# EAGLE design wheelSense_revA (EAGLE 8.0.0)
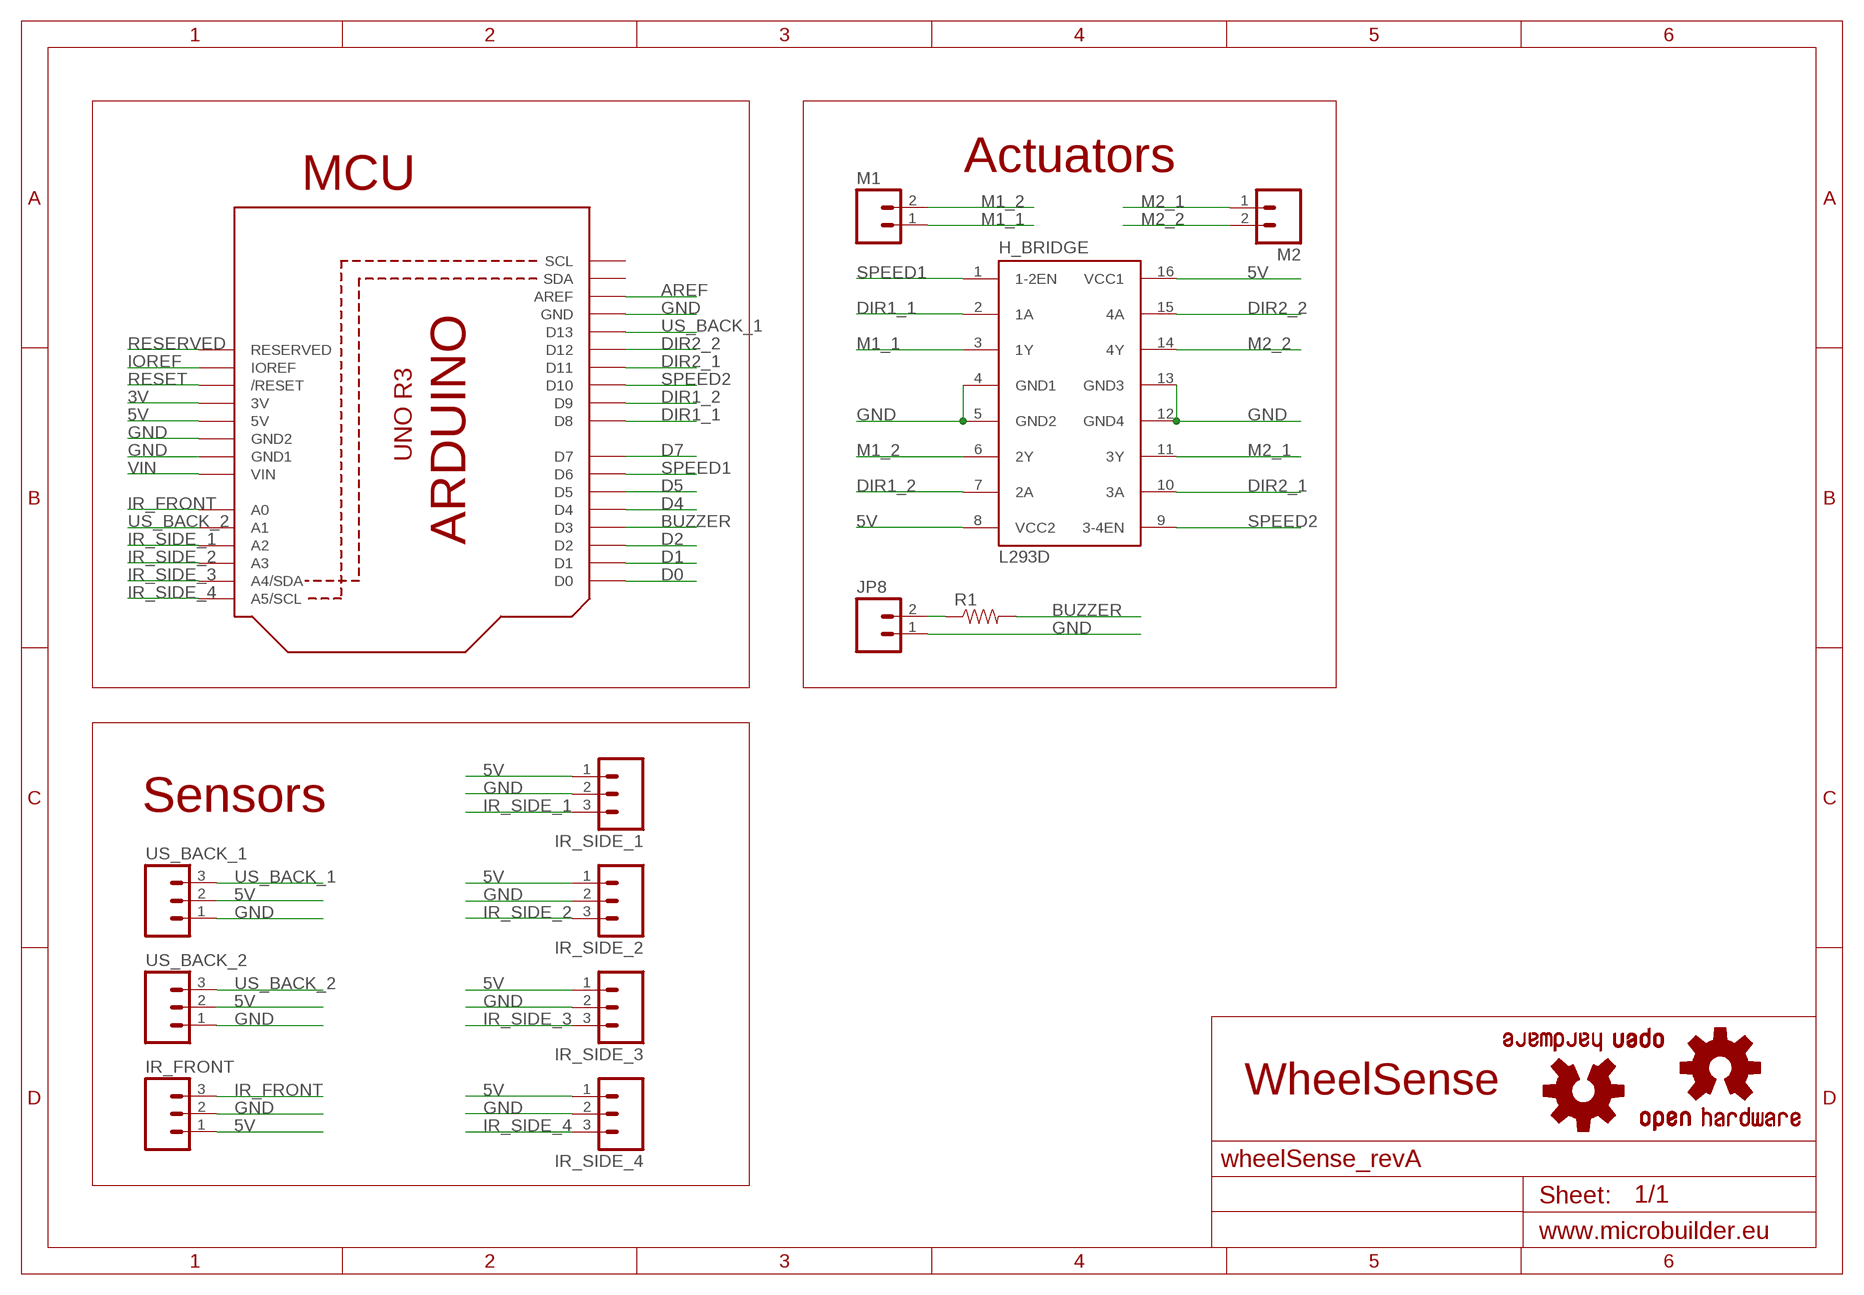
[diagram p0: schematic, sheet 1]

## Parts
H_BRIDGE  L293D  [DIL16]
IR_FRONT  M03POLAR  [MOLEX-1X3]
IR_SIDE_1  M03POLAR  [MOLEX-1X3]
IR_SIDE_2  M03POLAR  [MOLEX-1X3]
IR_SIDE_3  M03POLAR  [MOLEX-1X3]
IR_SIDE_4  M03POLAR  [MOLEX-1X3]
JP8  M02POLAR  [MOLEX-1X2]
LOGO1  OSHW-LOGOL-TOP  [OSHW_LOGO_L_TOP]
LOGO2  OSHW-LOGOL-TOP  [OSHW_LOGO_L_TOP]
M1  M02POLAR  [MOLEX-1X2]
M2  M02POLAR  [MOLEX-1X2]
R1  RESISTORPTH-1/4W  [AXIAL-0.4]
U$1  ARDUIN0R3_NOHOLES  [ARDUINOR3-NOHOLES]
US_BACK_1  M03POLAR  [MOLEX-1X3]
US_BACK_2  M03POLAR  [MOLEX-1X3]

## Nets
3V: U$1.3V
5V: H_BRIDGE.8(VCC2) H_BRIDGE.16(VCC1) IR_FRONT.1 IR_SIDE_1.1 IR_SIDE_2.1 IR_SIDE_3.1 IR_SIDE_4.1 U$1.5V US_BACK_1.2 US_BACK_2.2
AREF: U$1.AREF
BUZZER: R1.P$2 U$1.D3
D0: U$1.D0
D1: U$1.D1
D2: U$1.D2
D4: U$1.D4
D5: U$1.D5
D7: U$1.D7
DIR1_1: H_BRIDGE.2(1A) U$1.D8
DIR1_2: H_BRIDGE.7(2A) U$1.D9
DIR2_1: H_BRIDGE.10(3A) U$1.D11
DIR2_2: H_BRIDGE.15(4A) U$1.D12
GND: H_BRIDGE.4(GND1) H_BRIDGE.5(GND2) H_BRIDGE.12(GND4) H_BRIDGE.13(GND3) IR_FRONT.2 IR_SIDE_1.2 IR_SIDE_2.2 IR_SIDE_3.2 IR_SIDE_4.2 JP8.1 U$1.GND U$1.GND1 U$1.GND2 US_BACK_1.1 US_BACK_2.1
IOREF: U$1.IOREF
IR_FRONT: IR_FRONT.3 U$1.A0
IR_SIDE_1: IR_SIDE_1.3 U$1.A2
IR_SIDE_2: IR_SIDE_2.3 U$1.A3
IR_SIDE_3: IR_SIDE_3.3 U$1.A4(A4/SDA)
IR_SIDE_4: IR_SIDE_4.3 U$1.A5(A5/SCL)
M1_1: H_BRIDGE.3(1Y) M1.1
M1_2: H_BRIDGE.6(2Y) M1.2
M2_1: H_BRIDGE.11(3Y) M2.1
M2_2: H_BRIDGE.14(4Y) M2.2
N$1: JP8.2 R1.P$1
RESERVED: U$1.RESERVED
RESET: U$1.RESET(/RESET)
SPEED1: H_BRIDGE.1(1-2EN) U$1.D6
SPEED2: H_BRIDGE.9(3-4EN) U$1.D10
US_BACK_1: U$1.D13 US_BACK_1.3
US_BACK_2: U$1.A1 US_BACK_2.3
VIN: U$1.VIN
Unconnected: U$1.SCL U$1.SDA

## Notes on the sheet
- Actuators
- MCU
- Sensors
- WheelSense

## Library data of the parts
H_BRIDGE = st-microelectronics:L293D: PUSH-PULL 4 CHANNEL DRIVER; MPN: L293D; OC_FARNELL: 9589619; OC_NEWARK: 56P8249
IR_FRONT IR_SIDE_1-IR_SIDE_4 US_BACK_1 US_BACK_2 = SparkFun-Connectors:M03: Header 3 Standard 3-pin 0.1" header. Use with straight break away headers (SKU : PRT-00116), right angle break away headers (PRT-00553), swiss pins (PRT-00743), machine pins (PRT-00117), and female headers (PRT-00115). Molex polarized connector foot print use with SKU : PRT-08232 with associated crimp pins and housings.
JP8 M1 M2 = SparkFun-Connectors:M02: Standard 2-pin 0.1" header. Use with - straight break away headers ( PRT-00116) - right angle break away headers (PRT-00553) - swiss pins (PRT-00743) - machine pins (PRT-00117) - female headers (PRT-00115) Molex polarized connector foot print use with: PRT-08233 with associated crimp pins and housings. 2.54_SCREWTERM for use with PRT-10571. 3.5mm Screw Terminal footprints for PRT-08084 5mm Screw Terminal footprints for use with PRT-08432
LOGO1 LOGO2 = SparkFun-Aesthetics:OSHW-LOGO: Open Source Hardware Logo This logo indicates the piece of hardware it is found on incorporates a OSHW license and/or adheres to the definition of open source hardware found here: http://freedomdefined.org/OSHW
R1 = SparkFun-Passives:RESISTOR: Resistor Basic schematic elements and footprints for 0603, 1206, and PTH resistors.
U$1 = adafruit:ARDUIN0R3_NOHOLES

## Board
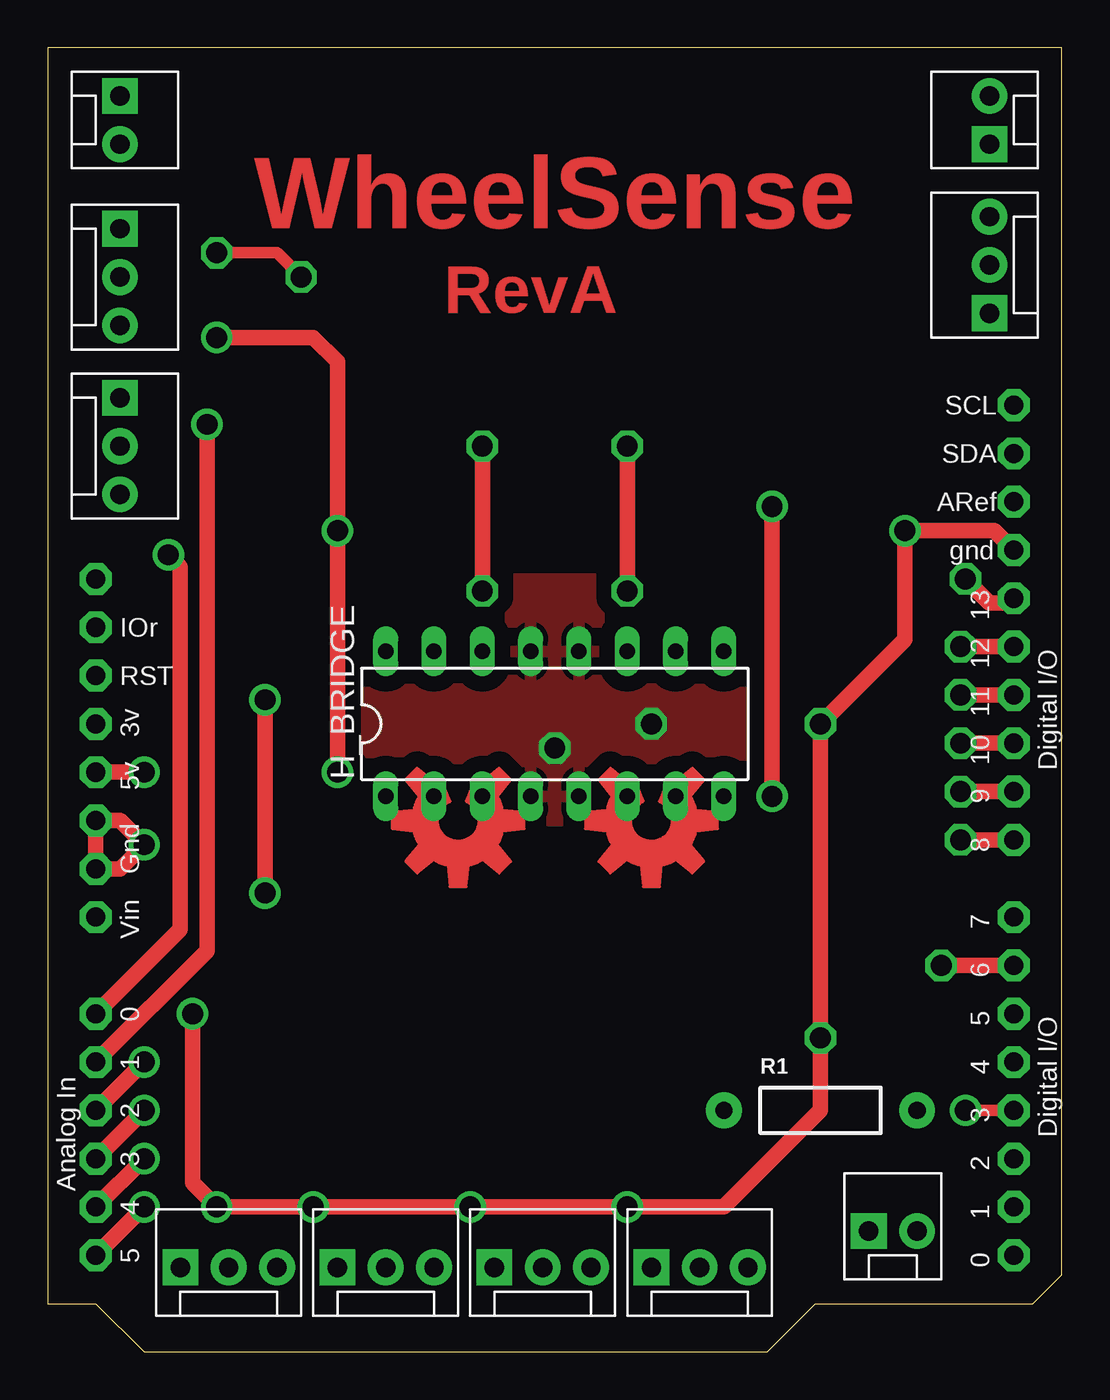
[diagram p1: board, top side]
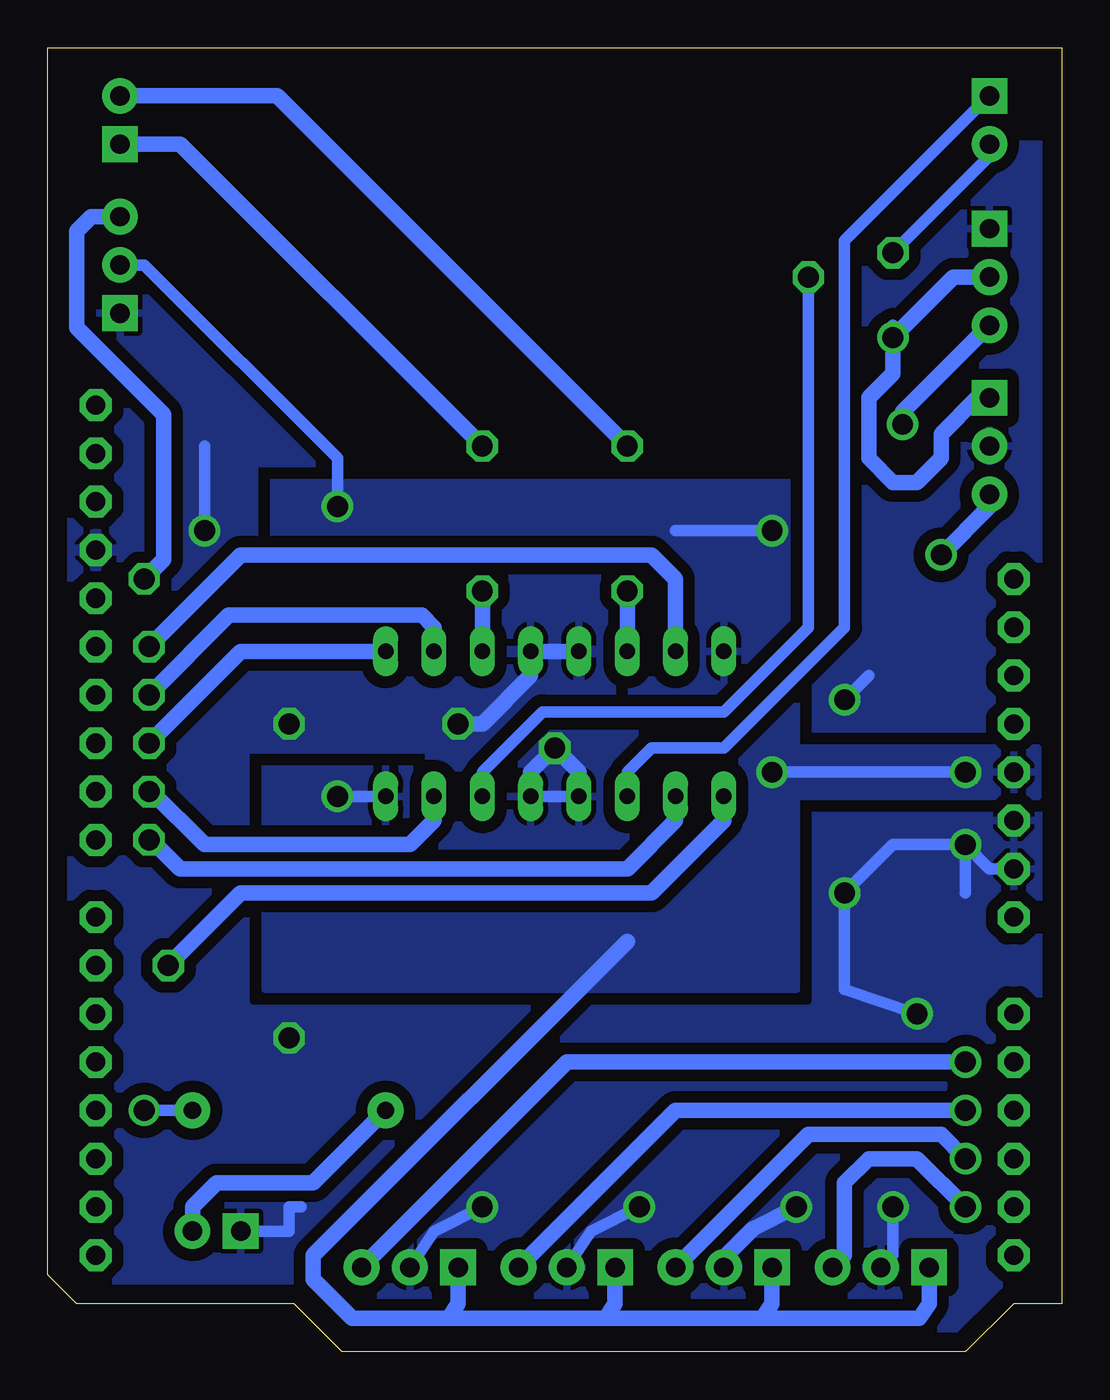
[diagram p2: board, bottom side, seen from below]

Size 53.34 x 68.58 mm. Coordinates in mm from the lower left corner, seen from the top.
Copper layers (1*16): Top 0.035mm / dielectric 1.5mm / Bottom 0.035mm
Design rules "default": minimum track width 10mil, minimum drill 24mil, track to track 8mil, track to pad 8mil, pad to pad 8mil, via to via 8mil, smd to smd 8mil, copper to edge 40mil, drill to drill 8mil, minimum pad ring 10mil, minimum via ring 8mil, stop-mask expansion 4mil, vias tented up to drill 0mil, thermal gap 10mil

### Footprints (pad centres in the part's own frame; a part is rotated, then mirrored left to right if it is on the bottom)
DIL16 = drill 0.813 long: 1 -8.89,-3.81; 2 -6.35,-3.81; 3 -3.81,-3.81; 4 -1.27,-3.81; 5 1.27,-3.81; 6 3.81,-3.81; 7 6.35,-3.81; 8 8.89,-3.81; 9 8.89,3.81; 10 6.35,3.81; 11 3.81,3.81; 12 1.27,3.81; 13 -1.27,3.81; 14 -3.81,3.81; 15 -6.35,3.81; 16 -8.89,3.81
MOLEX-1X3 = drill 1.016 pad 1.88 square: 1 0,0 | drill 1.016 pad 1.88: 2 2.54,0; 3 5.08,0
MOLEX-1X2 = drill 1.016 pad 1.88 square: 1 0,0 | drill 1.016 pad 1.88: 2 2.54,0
AXIAL-0.4 = drill 0.9 pad 1.88: P$1 -5.08,0; P$2 5.08,0
ARDUINOR3-NOHOLES = drill 1 pad 1.676 octagon: 3V 2.54,-24.13; 5V 5.08,-24.13; A0 17.78,-24.13; A1 20.32,-24.13; A2 22.86,-24.13; A3 25.4,-24.13; A4 27.94,-24.13; A5 30.48,-24.13; AREF -9.144,24.13; D0 30.48,24.13; D1 27.94,24.13; D2 25.4,24.13; D3 22.86,24.13; D4 20.32,24.13; D5 17.78,24.13; D6 15.24,24.13; D7 12.7,24.13; D8 8.636,24.13; D9 6.096,24.13; D10 3.556,24.13; D11 1.016,24.13; D12 -1.524,24.13; D13 -4.064,24.13; GND -6.604,24.13; GND1 10.16,-24.13; GND2 7.62,-24.13; IOREF -2.54,-24.13; RESERVED -5.08,-24.13; RESET 0,-24.13; SCL -14.224,24.13; SDA -11.684,24.13; VIN 12.7,-24.13

### Placement (x,y rotation side)
H_BRIDGE  26.67,33.02 0 top
IR_FRONT  3.81,50.16 270 top
IR_SIDE_1  31.75,4.45 0 top
IR_SIDE_2  23.5,4.45 0 top
IR_SIDE_3  15.24,4.45 0 top
IR_SIDE_4  6.99,4.45 0 top
JP8  43.18,6.35 0 top
LOGO1  31.75,27.94 180 top
LOGO2  21.59,27.94 180 top
M1  3.81,66.04 270 top
M2  49.53,63.5 90 top
R1  40.64,12.7 0 top
U$1  26.67,35.56 270 top
US_BACK_1  49.53,54.61 90 top
US_BACK_2  3.81,59.05 270 top

### Tracks (layer width: path | path; a pad name or v marks a point on that pad's centre or on a via)
5V  (via drill 1.1)
  Top 0.813: v15.24,30.48 v15.24,43.18 15.24,52.07 13.97,53.34 v8.89,53.34 | v38.1,29.21 v38.1,44.45 | U$1.5V v5.08,30.48
  Bottom 0.61: v15.24,43.18 20.32,43.18 | H_BRIDGE.8 v38.1,29.21 | v5.08,30.48 v15.24,30.48 | 8.89,53.98 v8.89,53.34 | US_BACK_1.2 48.26,57.15 38.1,46.99 v38.1,44.45
  Bottom 0.813: 32.26,1.78 37.34,1.78 39.37,3.81 39.37,5.08 22.86,21.59 | 32.26,1.78 24,1.78 | 24,1.78 15.75,1.78 | 15.75,1.78 7.49,1.78 6.99,2.54 IR_SIDE_4.1 | IR_SIDE_3.1 15.24,2.54 15.75,1.78 | IR_SIDE_2.1 23.5,2.54 24,1.78 | IR_SIDE_1.1 31.75,2.54 32.26,1.78 | IR_FRONT.1 4.45,50.16 6.35,48.26 6.35,46.99 7.62,45.72 8.89,45.72 10.16,46.99 10.16,50.16 8.89,51.44 v8.89,53.34 5.72,56.52 US_BACK_2.2
  pour Bottom (isolate 0.61, rank 2): 1.27,29.21 13.97,29.21 13.97,19.05 41.91,19.05 41.91,45.72 13.97,45.72 13.97,31.75 1.27,31.75
BUZZER  (via drill 1.1)
  Top 0.61: U$1.D3 v48.26,12.7
  Bottom 0.61: v48.26,12.7 R1.P$2
DIR1_1  (via drill 1.1)
  Top 0.813: U$1.D8 v48.01,26.92
  Bottom 0.813: H_BRIDGE.2 20.32,27.94 22.86,25.4 46.36,25.4 47.88,26.92 v48.01,26.92
DIR1_2  (via drill 1.1)
  Top 0.813: U$1.D9 v48.01,29.46
  Bottom 0.813: H_BRIDGE.7 33.02,27.94 34.29,26.67 45.09,26.67 47.88,29.46 v48.01,29.46
DIR2_1  (via drill 1.1)
  Top 0.813: U$1.D11 v48.01,34.54
  Bottom 0.813: v48.01,34.54 43.81,38.73 33.66,38.73 33.02,38.1 H_BRIDGE.10
DIR2_2  (via drill 1.1)
  Top 0.813: U$1.D12 v48.01,37.08
  Bottom 0.61: 50.42,37.47 U$1.D12
  Bottom 0.813: 20.32,38.1 H_BRIDGE.15 20.32,40.64 21.59,41.91 43.18,41.91 v48.01,37.08
GND  (via drill 1.1)
  Top 0.813: v11.43,24.13 v11.43,34.29 | v7.62,17.78 7.62,8.89 v8.89,7.62 v13.97,7.62 v22.23,7.62 v30.48,7.62 35.56,7.62 40.64,12.7 v40.64,16.51 v40.64,33.02 45.09,37.47 v45.09,43.18 49.78,43.18 U$1.GND | U$1.GND2 U$1.GND1 3.81,25.4 v5.08,26.67 3.81,27.94 U$1.GND2
  Bottom 0.61: JP8.1 40.64,6.35 40.64,7.62 40.01,7.62 | H_BRIDGE.5 H_BRIDGE.4 | 50.55,41.91 U$1.GND | U$1.GND1 3.81,25.4 v5.08,26.67 | v5.08,26.67 8.89,26.67 v11.43,24.13 11.43,19.05 v7.62,17.78 | v11.43,34.29 10.16,35.56 | v8.89,7.62 8.89,5.08 IR_SIDE_4.2 | 16.51,6.35 16.26,6.48 | IR_SIDE_3.2 17.78,5.08 17.65,5.08 | IR_SIDE_2.2 24.77,6.35 v22.23,7.62 | IR_SIDE_1.2 33.02,6.35 v30.48,7.62 | v5.08,26.67 5.08,24.13 | v45.09,43.18 45.09,47.62
  Bottom 0.813: v13.97,7.62 16.26,6.48 17.65,5.08 | H_BRIDGE.4 25.4,30.48 v26.67,31.75 27.94,30.48 H_BRIDGE.5 | H_BRIDGE.13 H_BRIDGE.12 27.94,35.56 30.48,33.02 v31.75,33.02
  pour Bottom (isolate 0.61, rank 3): -2.54,63.5 77.47,63.5 77.47,-5.08 -2.54,-5.08
  pour Bottom (isolate 0.61): 19.05,36.83 19.05,31.75 54.61,31.75 54.61,46.99 42.55,46.99 42.55,36.83
  pour Top (isolate 0.813): 15.24,40.64 15.24,27.94 38.1,27.94 38.1,40.64
IR_FRONT  (via drill 1.1)
  Top 0.813: U$1.A0 6.99,22.23 6.99,41.27 v6.35,41.91
  Bottom 0.813: IR_FRONT.3 3.81,44.45 v6.35,41.91
IR_SIDE_1  (via drill 1.1)
  Top 0.813: U$1.A2 v5.08,15.24
  Bottom 0.813: IR_SIDE_1.3 26.04,15.24 v5.08,15.24
IR_SIDE_2  (via drill 1.1)
  Top 0.813: U$1.A3 v5.08,12.7
  Bottom 0.813: v5.08,12.7 20.32,12.7 IR_SIDE_2.3
IR_SIDE_3  (via drill 1.1)
  Top 0.813: U$1.A4 v5.08,10.16
  Bottom 0.813: IR_SIDE_3.3 13.34,11.43 6.35,11.43 v5.08,10.16
IR_SIDE_4  (via drill 1.1)
  Top 0.813: v5.08,7.62 U$1.A5
  Bottom 0.813: IR_SIDE_4.3 11.43,5.08 11.43,8.89 10.16,10.16 7.62,10.16 v5.08,7.62
M1_1
  Bottom 0.61: H_BRIDGE.3 22.86,30.48 21.59,31.75 17.78,31.75 11.43,38.1 11.43,58.42 M1.1
M1_2  (via drill 1.1)
  Top 0.61: v13.34,56.52 12.07,57.78 v8.89,57.78
  Bottom 0.61: H_BRIDGE.6 30.48,30.48 27.3,33.66 17.78,33.66 13.34,38.1 v13.34,56.52 | v8.89,57.78 3.81,62.87 M1.2
M2_1  (via drill 1.1)
  Top 0.813: v30.48,47.62 v30.48,40.01
  Bottom 0.813: M2.1 46.36,63.5 v30.48,47.62 | v30.48,40.01 H_BRIDGE.11
M2_2  (via drill 1.1)
  Top 0.813: v22.86,40.01 v22.86,47.62
  Bottom 0.813: v22.86,47.62 41.27,66.04 M2.2 | H_BRIDGE.14 v22.86,40.01
N$1
  Bottom 0.813: JP8.2 45.72,7.62 44.45,8.89 39.37,8.89 R1.P$1
SPEED1  (via drill 1.1)
  Top 0.813: U$1.D6 v46.99,20.32
  Bottom 0.813: v46.99,20.32 43.18,24.13 21.59,24.13 17.78,27.94 H_BRIDGE.1
SPEED2  (via drill 1.1)
  Top 0.813: U$1.D10 v48.01,32
  Bottom 0.813: v48.01,32 43.18,36.83 H_BRIDGE.9
US_BACK_1  (via drill 1.1)
  Top 0.813: v48.26,40.64 49.53,39.37 50.55,39.37 U$1.D13
  Bottom 0.813: US_BACK_1.3 51.05,59.69 51.82,58.93 51.82,53.85 47.24,49.28 47.24,41.66 v48.26,40.64
US_BACK_2  (via drill 1.1)
  Top 0.813: v8.38,48.77 8.38,21.08 U$1.A1
  Bottom 0.61: 8.38,49.4 v8.38,48.77
  Bottom 0.813: v8.38,48.77 8.38,49.4 US_BACK_2.3

### Text on the board
Top: WheelSense | RevA